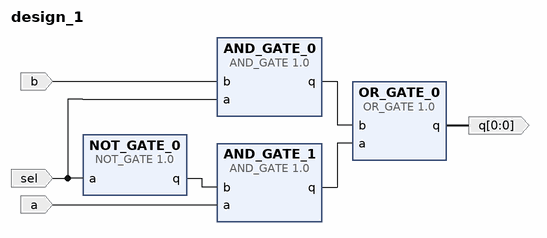
[diagram p0: block diagram of the top level]
# Vivado block design design_1, xc7a100tfgg484-1, Vivado 2017.4
create_bd_design design_1

create_bd_port -dir I a
create_bd_port -dir I b
create_bd_port -dir O -from 0 -to 0 q
create_bd_port -dir I sel

create_bd_cell -type ip -vlnv WYCER:GATES:AND_GATE:1.0 AND_GATE_0
set_property -dict {CONFIG.WIDTH 1} [get_bd_cells AND_GATE_0]
create_bd_cell -type ip -vlnv WYCER:GATES:NOT_GATE:1.0 NOT_GATE_0
set_property -dict {CONFIG.WIDTH 1} [get_bd_cells NOT_GATE_0]
create_bd_cell -type ip -vlnv WYCER:GATES:AND_GATE:1.0 AND_GATE_1
set_property -dict {CONFIG.WIDTH 1} [get_bd_cells AND_GATE_1]
create_bd_cell -type ip -vlnv WYCER:GATES:OR_GATE:1.0 OR_GATE_0
set_property -dict {CONFIG.WIDTH 1} [get_bd_cells OR_GATE_0]

# ---- connections ----

connect_bd_net [get_bd_ports b] [get_bd_pins AND_GATE_0/b]
connect_bd_net [get_bd_pins NOT_GATE_0/q] [get_bd_pins AND_GATE_1/b]
connect_bd_net [get_bd_ports a] [get_bd_pins AND_GATE_1/a]
connect_bd_net [get_bd_pins OR_GATE_0/q] [get_bd_ports q]
connect_bd_net [get_bd_ports sel] [get_bd_pins NOT_GATE_0/a] [get_bd_pins AND_GATE_0/a]
connect_bd_net [get_bd_pins AND_GATE_1/q] [get_bd_pins OR_GATE_0/a]
connect_bd_net [get_bd_pins AND_GATE_0/q] [get_bd_pins OR_GATE_0/b]

validate_bd_design
save_bd_design
